# Altium schematic sheet FPGA_HPCC_B_BG13-15-16.SchDoc
size B; SheetNumber: 8; SheetTotal: 11
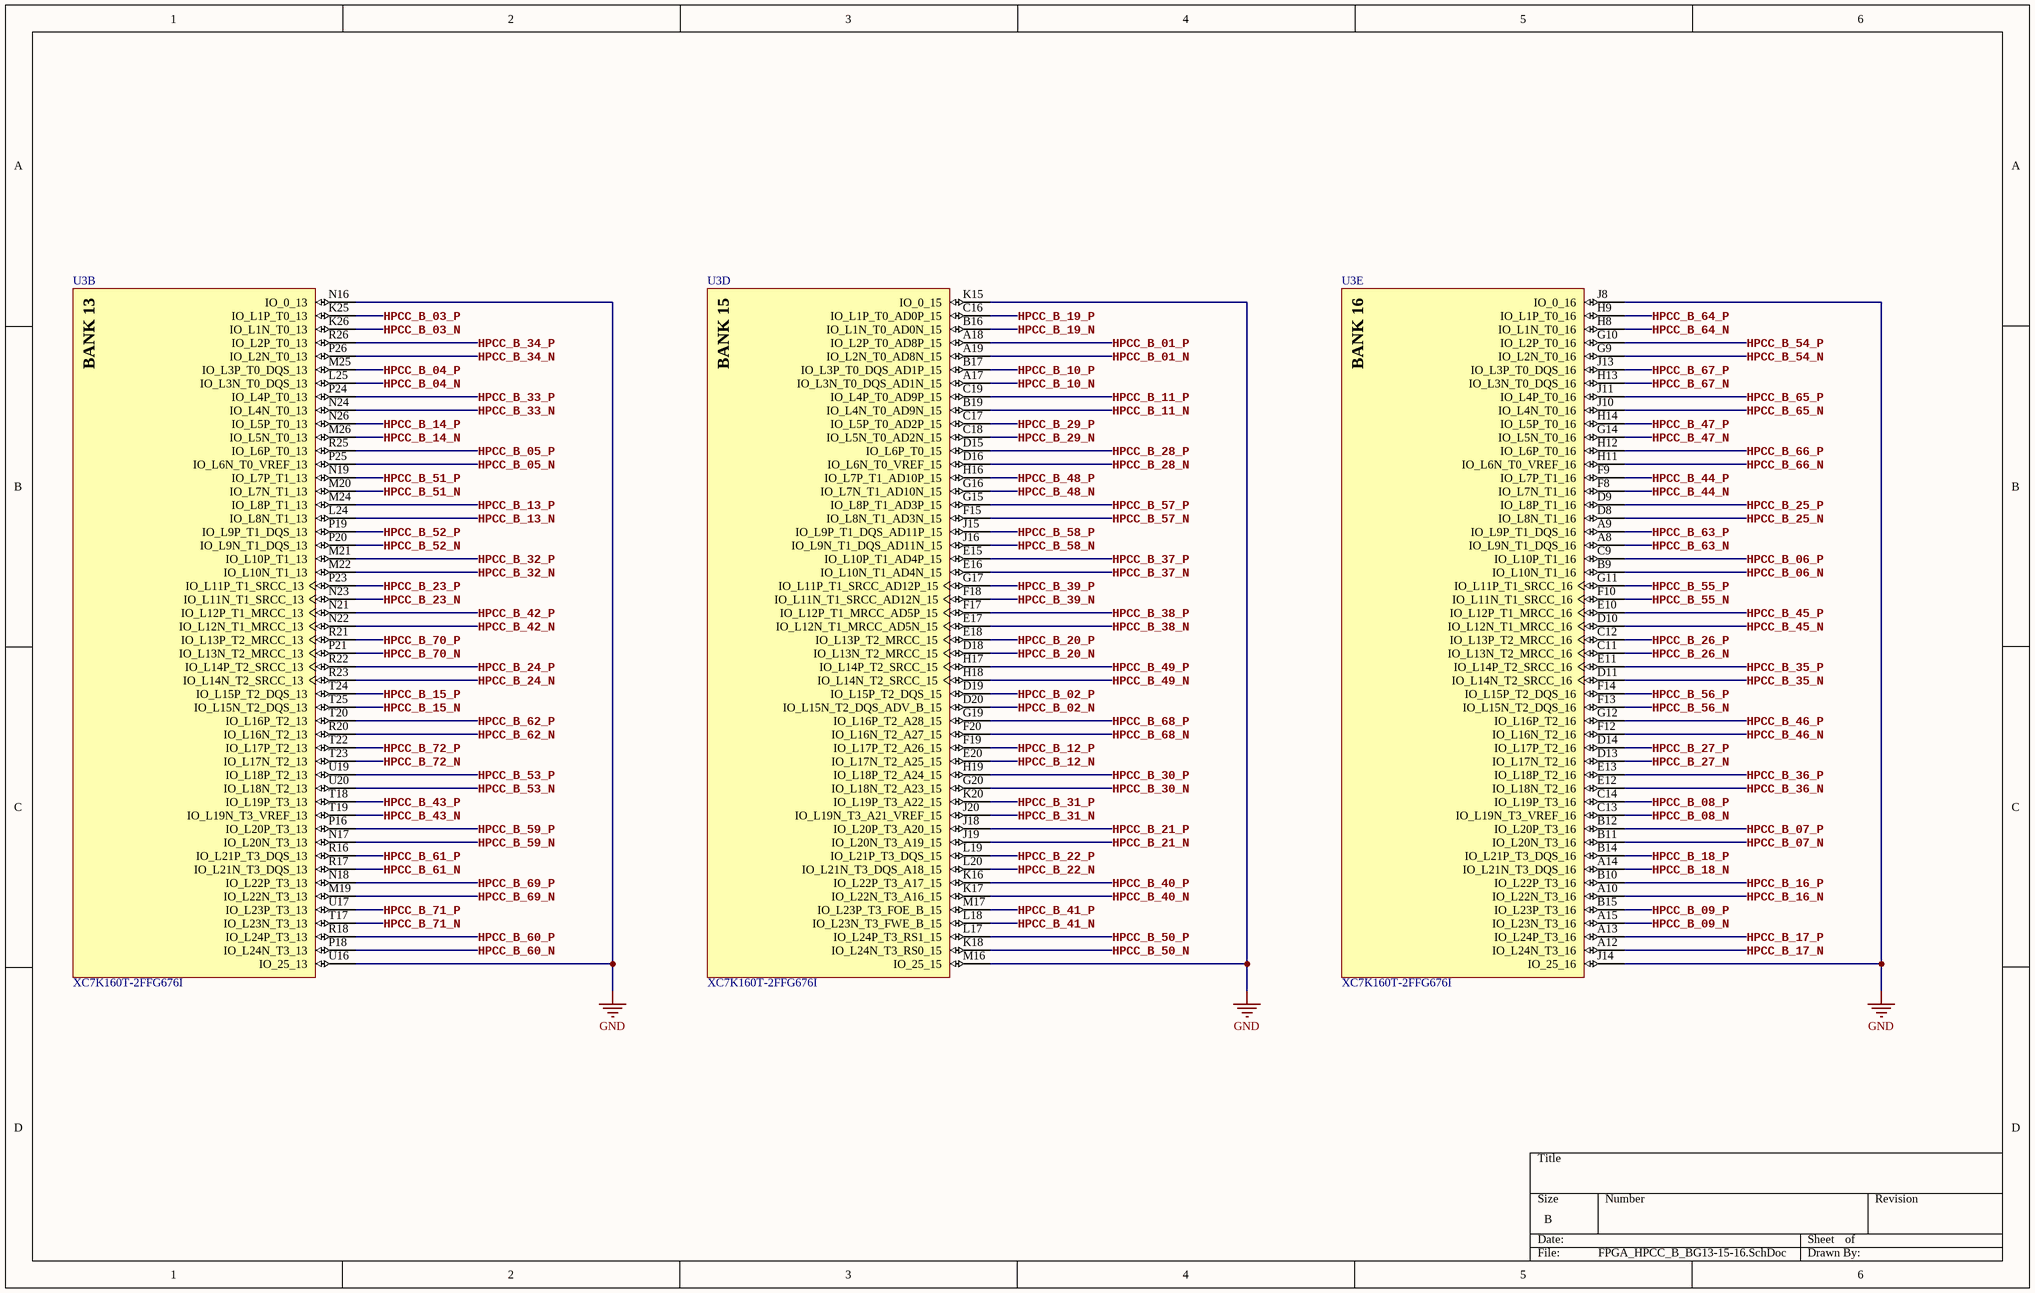
[diagram p0: FPGA_HPCC_B_BG13-15-16.SchDoc]

## Parts
U3  XC7K160T-2FFG676I  [FFG676_(XC7K160T-2FFG676I)]  (parts B,D,E of 14)

## Nets
GND: U3.J8(IO_0_16) U3.J14(IO_25_16) U3.K15(IO_0_15) U3.M16(IO_25_15) U3.N16(IO_0_13) U3.U16(IO_25_13)
HPCC_B_01_N: U3.A19(IO_L2N_T0_AD8N_15)
HPCC_B_01_P: U3.A18(IO_L2P_T0_AD8P_15)
HPCC_B_02_N: U3.D20(IO_L15N_T2_DQS_ADV_B_15)
HPCC_B_02_P: U3.D19(IO_L15P_T2_DQS_15)
HPCC_B_03_N: U3.K26(IO_L1N_T0_13)
HPCC_B_03_P: U3.K25(IO_L1P_T0_13)
HPCC_B_04_N: U3.L25(IO_L3N_T0_DQS_13)
HPCC_B_04_P: U3.M25(IO_L3P_T0_DQS_13)
HPCC_B_05_N: U3.P25(IO_L6N_T0_VREF_13)
HPCC_B_05_P: U3.R25(IO_L6P_T0_13)
HPCC_B_06_N: U3.B9(IO_L10N_T1_16)
HPCC_B_06_P: U3.C9(IO_L10P_T1_16)
HPCC_B_07_N: U3.B11(IO_L20N_T3_16)
HPCC_B_07_P: U3.B12(IO_L20P_T3_16)
HPCC_B_08_N: U3.C13(IO_L19N_T3_VREF_16)
HPCC_B_08_P: U3.C14(IO_L19P_T3_16)
HPCC_B_09_N: U3.A15(IO_L23N_T3_16)
HPCC_B_09_P: U3.B15(IO_L23P_T3_16)
HPCC_B_10_N: U3.A17(IO_L3N_T0_DQS_AD1N_15)
HPCC_B_10_P: U3.B17(IO_L3P_T0_DQS_AD1P_15)
HPCC_B_11_N: U3.B19(IO_L4N_T0_AD9N_15)
HPCC_B_11_P: U3.C19(IO_L4P_T0_AD9P_15)
HPCC_B_12_N: U3.E20(IO_L17N_T2_A25_15)
HPCC_B_12_P: U3.F19(IO_L17P_T2_A26_15)
HPCC_B_13_N: U3.L24(IO_L8N_T1_13)
HPCC_B_13_P: U3.M24(IO_L8P_T1_13)
HPCC_B_14_N: U3.M26(IO_L5N_T0_13)
HPCC_B_14_P: U3.N26(IO_L5P_T0_13)
HPCC_B_15_N: U3.T25(IO_L15N_T2_DQS_13)
HPCC_B_15_P: U3.T24(IO_L15P_T2_DQS_13)
HPCC_B_16_N: U3.A10(IO_L22N_T3_16)
HPCC_B_16_P: U3.B10(IO_L22P_T3_16)
HPCC_B_17_N: U3.A12(IO_L24N_T3_16)
HPCC_B_17_P: U3.A13(IO_L24P_T3_16)
HPCC_B_18_N: U3.A14(IO_L21N_T3_DQS_16)
HPCC_B_18_P: U3.B14(IO_L21P_T3_DQS_16)
HPCC_B_19_N: U3.B16(IO_L1N_T0_AD0N_15)
HPCC_B_19_P: U3.C16(IO_L1P_T0_AD0P_15)
HPCC_B_20_N: U3.D18(IO_L13N_T2_MRCC_15)
HPCC_B_20_P: U3.E18(IO_L13P_T2_MRCC_15)
HPCC_B_21_N: U3.J19(IO_L20N_T3_A19_15)
HPCC_B_21_P: U3.J18(IO_L20P_T3_A20_15)
HPCC_B_22_N: U3.L20(IO_L21N_T3_DQS_A18_15)
HPCC_B_22_P: U3.L19(IO_L21P_T3_DQS_15)
HPCC_B_23_N: U3.N23(IO_L11N_T1_SRCC_13)
HPCC_B_23_P: U3.P23(IO_L11P_T1_SRCC_13)
HPCC_B_24_N: U3.R23(IO_L14N_T2_SRCC_13)
HPCC_B_24_P: U3.R22(IO_L14P_T2_SRCC_13)
HPCC_B_25_N: U3.D8(IO_L8N_T1_16)
HPCC_B_25_P: U3.D9(IO_L8P_T1_16)
HPCC_B_26_N: U3.C11(IO_L13N_T2_MRCC_16)
HPCC_B_26_P: U3.C12(IO_L13P_T2_MRCC_16)
HPCC_B_27_N: U3.D13(IO_L17N_T2_16)
HPCC_B_27_P: U3.D14(IO_L17P_T2_16)
HPCC_B_28_N: U3.D16(IO_L6N_T0_VREF_15)
HPCC_B_28_P: U3.D15(IO_L6P_T0_15)
HPCC_B_29_N: U3.C18(IO_L5N_T0_AD2N_15)
HPCC_B_29_P: U3.C17(IO_L5P_T0_AD2P_15)
HPCC_B_30_N: U3.G20(IO_L18N_T2_A23_15)
HPCC_B_30_P: U3.H19(IO_L18P_T2_A24_15)
HPCC_B_31_N: U3.J20(IO_L19N_T3_A21_VREF_15)
HPCC_B_31_P: U3.K20(IO_L19P_T3_A22_15)
HPCC_B_32_N: U3.M22(IO_L10N_T1_13)
HPCC_B_32_P: U3.M21(IO_L10P_T1_13)
HPCC_B_33_N: U3.N24(IO_L4N_T0_13)
HPCC_B_33_P: U3.P24(IO_L4P_T0_13)
HPCC_B_34_N: U3.P26(IO_L2N_T0_13)
HPCC_B_34_P: U3.R26(IO_L2P_T0_13)
HPCC_B_35_N: U3.D11(IO_L14N_T2_SRCC_16)
HPCC_B_35_P: U3.E11(IO_L14P_T2_SRCC_16)
HPCC_B_36_N: U3.E12(IO_L18N_T2_16)
HPCC_B_36_P: U3.E13(IO_L18P_T2_16)
HPCC_B_37_N: U3.E16(IO_L10N_T1_AD4N_15)
HPCC_B_37_P: U3.E15(IO_L10P_T1_AD4P_15)
HPCC_B_38_N: U3.E17(IO_L12N_T1_MRCC_AD5N_15)
HPCC_B_38_P: U3.F17(IO_L12P_T1_MRCC_AD5P_15)
HPCC_B_39_N: U3.F18(IO_L11N_T1_SRCC_AD12N_15)
HPCC_B_39_P: U3.G17(IO_L11P_T1_SRCC_AD12P_15)
HPCC_B_40_N: U3.K17(IO_L22N_T3_A16_15)
HPCC_B_40_P: U3.K16(IO_L22P_T3_A17_15)
HPCC_B_41_N: U3.L18(IO_L23N_T3_FWE_B_15)
HPCC_B_41_P: U3.M17(IO_L23P_T3_FOE_B_15)
HPCC_B_42_N: U3.N22(IO_L12N_T1_MRCC_13)
HPCC_B_42_P: U3.N21(IO_L12P_T1_MRCC_13)
HPCC_B_43_N: U3.T19(IO_L19N_T3_VREF_13)
HPCC_B_43_P: U3.T18(IO_L19P_T3_13)
HPCC_B_44_N: U3.F8(IO_L7N_T1_16)
HPCC_B_44_P: U3.F9(IO_L7P_T1_16)
HPCC_B_45_N: U3.D10(IO_L12N_T1_MRCC_16)
HPCC_B_45_P: U3.E10(IO_L12P_T1_MRCC_16)
HPCC_B_46_N: U3.F12(IO_L16N_T2_16)
HPCC_B_46_P: U3.G12(IO_L16P_T2_16)
HPCC_B_47_N: U3.G14(IO_L5N_T0_16)
HPCC_B_47_P: U3.H14(IO_L5P_T0_16)
HPCC_B_48_N: U3.G16(IO_L7N_T1_AD10N_15)
HPCC_B_48_P: U3.H16(IO_L7P_T1_AD10P_15)
HPCC_B_49_N: U3.H18(IO_L14N_T2_SRCC_15)
HPCC_B_49_P: U3.H17(IO_L14P_T2_SRCC_15)
HPCC_B_50_N: U3.K18(IO_L24N_T3_RS0_15)
HPCC_B_50_P: U3.L17(IO_L24P_T3_RS1_15)
HPCC_B_51_N: U3.M20(IO_L7N_T1_13)
HPCC_B_51_P: U3.N19(IO_L7P_T1_13)
HPCC_B_52_N: U3.P20(IO_L9N_T1_DQS_13)
HPCC_B_52_P: U3.P19(IO_L9P_T1_DQS_13)
HPCC_B_53_N: U3.U20(IO_L18N_T2_13)
HPCC_B_53_P: U3.U19(IO_L18P_T2_13)
HPCC_B_54_N: U3.G9(IO_L2N_T0_16)
HPCC_B_54_P: U3.G10(IO_L2P_T0_16)
HPCC_B_55_N: U3.F10(IO_L11N_T1_SRCC_16)
HPCC_B_55_P: U3.G11(IO_L11P_T1_SRCC_16)
HPCC_B_56_N: U3.F13(IO_L15N_T2_DQS_16)
HPCC_B_56_P: U3.F14(IO_L15P_T2_DQS_16)
HPCC_B_57_N: U3.F15(IO_L8N_T1_AD3N_15)
HPCC_B_57_P: U3.G15(IO_L8P_T1_AD3P_15)
HPCC_B_58_N: U3.J16(IO_L9N_T1_DQS_AD11N_15)
HPCC_B_58_P: U3.J15(IO_L9P_T1_DQS_AD11P_15)
HPCC_B_59_N: U3.N17(IO_L20N_T3_13)
HPCC_B_59_P: U3.P16(IO_L20P_T3_13)
HPCC_B_60_N: U3.P18(IO_L24N_T3_13)
HPCC_B_60_P: U3.R18(IO_L24P_T3_13)
HPCC_B_61_N: U3.R17(IO_L21N_T3_DQS_13)
HPCC_B_61_P: U3.R16(IO_L21P_T3_DQS_13)
HPCC_B_62_N: U3.R20(IO_L16N_T2_13)
HPCC_B_62_P: U3.T20(IO_L16P_T2_13)
HPCC_B_63_N: U3.A8(IO_L9N_T1_DQS_16)
HPCC_B_63_P: U3.A9(IO_L9P_T1_DQS_16)
HPCC_B_64_N: U3.H8(IO_L1N_T0_16)
HPCC_B_64_P: U3.H9(IO_L1P_T0_16)
HPCC_B_65_N: U3.J10(IO_L4N_T0_16)
HPCC_B_65_P: U3.J11(IO_L4P_T0_16)
HPCC_B_66_N: U3.H11(IO_L6N_T0_VREF_16)
HPCC_B_66_P: U3.H12(IO_L6P_T0_16)
HPCC_B_67_N: U3.H13(IO_L3N_T0_DQS_16)
HPCC_B_67_P: U3.J13(IO_L3P_T0_DQS_16)
HPCC_B_68_N: U3.F20(IO_L16N_T2_A27_15)
HPCC_B_68_P: U3.G19(IO_L16P_T2_A28_15)
HPCC_B_69_N: U3.M19(IO_L22N_T3_13)
HPCC_B_69_P: U3.N18(IO_L22P_T3_13)
HPCC_B_70_N: U3.P21(IO_L13N_T2_MRCC_13)
HPCC_B_70_P: U3.R21(IO_L13P_T2_MRCC_13)
HPCC_B_71_N: U3.T17(IO_L23N_T3_13)
HPCC_B_71_P: U3.U17(IO_L23P_T3_13)
HPCC_B_72_N: U3.T23(IO_L17N_T2_13)
HPCC_B_72_P: U3.T22(IO_L17P_T2_13)

## Notes on the sheet
- (in symbol XC7K160T, part B) BANK 13
- (in symbol XC7K160T, part D) BANK 15
- (in symbol XC7K160T, part E) BANK 16

## Library data of the parts
U3 = XC7K160T: Kintex-7 FPGA, 400 User I/Os, 8 GTX, 676-Ball BGA, Speed Grade 2, Industrial Grade, Pb-Free; Manufacturer: AMD/Xilinx; Manufacturer Part Number: XC7K160T-2FFG676I